# Altium project Sensor de temperatura.PrjPcb
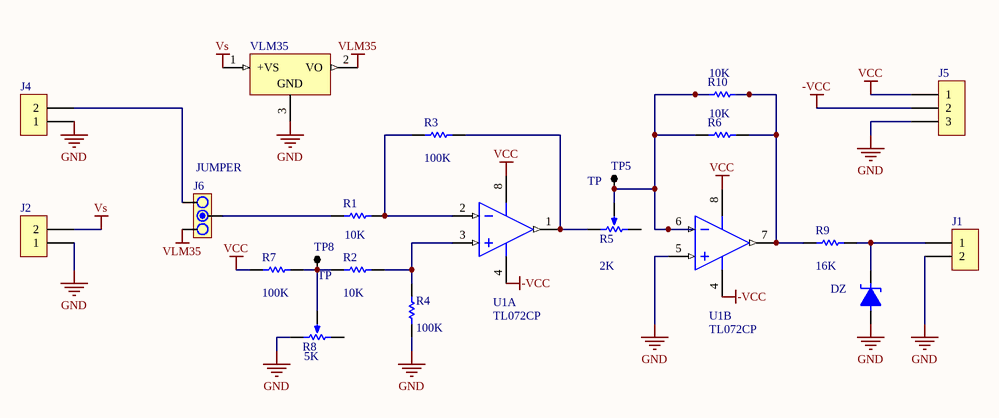
[diagram p0: Sheet1.SchDoc]
1 sheet, 20 parts. Net scope: global (net labels, ports and power ports of the same name join across sheets).
Board file: PCB1.PcbDoc

## Sheet Sheet1.SchDoc
size A4

### Parts
DZ  (no value)  [DO41]
J1  (no value)  [BORNERA2]
J2  (no value)  [BORNERA2]
J4  (no value)  [BORNERA2]
J5  (no value)  [BORNERA3]
J6  JUMPER  [JUMPER3]
R1  value 10K  [AXIAL-0.3]
R2  value 10K  [AXIAL-0.3]
R3  value 100K  [AXIAL-0.3]
R4  value 100K  [AXIAL-0.3]
R5  value 2K  [VR5]
R6  value 10K  [AXIAL-0.3]
R7  value 100K  [AXIAL-0.3]
R8  value 5K  [VR5]
R9  value 16K  [AXIAL-0.3]
R10  value 10K  [AXIAL-0.3]
TP5  TP  [TPTH]
TP8  TP  [TPTH]
U1  TL072CP  [TI-P8]  (parts A,B of 2)
VLM35  (no value)  [Z03A]

### Nets
-VCC: J5.2 U1.4(VCC-)
GND: DZ.1 J1.2 J2.1 J4.1 J5.3 R4.1 R8.2(BOT) U1.5(IN2+) VLM35.3(GND)
VCC: J5.1 R7.2 U1.8(VCC+)
VLM35: J6.1 VLM35.2(VO)
Vs: J2.2 VLM35.1(+VS)
NetDZ_2: DZ.2 J1.1 R9.1
NetJ4_2: J4.2 J6.3
NetJ6_2: J6.2 R1.1
NetR1_2: R1.2 R3.1 U1.2(IN1-)
NetR2_1: R2.1 R7.1 R8.3(TAP) TP8.1
NetR2_2: R2.2 R4.2 U1.3(IN1+)
NetR3_2: R3.2 R5.2(BOT) U1.1(OUT1)
NetR5_3: R5.3(TAP) R6.2 R10.1 TP5.1 U1.6(IN2-)
NetR6_1: R6.1 R9.2 R10.2 U1.7(OUT2)

Not connected (* = marked no-connect by the designer): R5 1(TOP); R8 1(TOP)

### Library data of the parts
DZ = DIODO ZENER
J1 J2 J4 = BORNERA 2
J5 = BORNERA 3
J6 = JUMPER3
R1-R4 R6 R7 R9 R10 = Res1: Resistor; Published: 8-Jun-2000; LatestRevisionDate: 17-Jul-2002; LatestRevisionNote: Re-released for DXP Platform.; PackageReference: AXIAL-0.3; Publisher: Altium Limited; PackageDescription: Axial Device, Thru-Hole; 2 Leads; 0.3 in Pin Spacing
R5 R8 = RPot: Potentiometer; Sim Note: Enter the Resistance value and the set point into parameter fields.; Set Position: 0.5; Published: 8-Jun-2000; LatestRevisionDate: 17-Jul-2002; LatestRevisionNote: Re-released for DXP Platform.; PackageReference: VR5; Publisher: Altium Limited; PackageDescription: Variable Resistor, Thru-Hole; 3 Leads
U1 = TL072CP: Dual Low-Noise JFET-Input General-Purpose Operational Amplifier, 7 to 36 V, 0 to 70 degC, 8-pin DIP (P8), Pb-Free (RoHS); Manufacturer: Texas Instruments; CMRR(Min)(dB): 70; GBW(Typ)(MHz): 3; IIB(Max)(pA): 200; Iq per channel(Max)(mA): 2.5; Number of Channels: 2; Offset Drift(Typ)(uV/C): 18; Rating: Catalog; Slew Rate(Typ)(V/us): 13; Sub Family: General Purpose Amplifier, High Supply Voltage Amplifier (>=30V); Total Supply Voltage(Max)(+5V is 5, +/-5V is 10): 36; Total Supply Voltage(Min)(+5V is 5, +/-5V is 10): 7; Vio (25C)(Max)(mV): 10; DatasheetVersion: SLOS080J; PackageVersion: 4040082/E, 04/2010; PackageReference: P8; PackageDescription: 8-Pin Plastic In-Line, Body 9.59 x 6.35 mm, Pitch 2.54 mm; Supplier 1: Digi-Key; Supplier Part Number 1: 296-1775-5-ND; Supplier 2: Farnell; Supplier Part Number 2: 1106015; Supplier 3: Newark; Supplier Part Number 3: 60K6988; Supplier 4: Mouser; Supplier Part Number 4: 595-TL072CP; Eco-Plan: Pb-Free (RoHS); Vn at 1kHz(Typ)(nV/rtHz): 18; Mounting Technology: Through Hole; Code_JEDEC: MS-001; PartNumber: TL072CP; ComponentLink1Description: Manufacturer URL; ComponentLink1URL: http://www.ti.com/; ComponentLink2Description: Datasheet; ComponentLink2URL: http://www.ti.com/lit/ds/symlink/tl072.pdf; ComponentLink3Description: Package Specification; ComponentLink3URL: http://www.ti.com/litv/pdf/mpdi001b
VLM35 = LM35CZ: Precision Centigrade Temperature Sensor, 3-pin TO-92; Manufacturer: National Semiconductor; PackageTopMarking: NSXYTT*LM35*CZ; PowerWise: N; CompType: Temp Sensor IC; Published: 4-Dec-2008; LatestRevisionDate: 15-Jul-2009; LatestRevisionNote: Sch pins 1 & 3 reversed.; DatasheetVersion: Nov-2000; PackageVersion: revG, Sep-2000; PackageReference: Z03A; Publisher: Altium Limited; PackageDescription: TO-92, Molded, 3 Lead; Supplier 1: Farnell; Supplier Part Number 1: 9488197; PartNumber: LM35CZ; RoHS: N; PinCount: 3; Code_JEDEC: TO-226-AA; ComponentLink1Description: LM35 Datasheet; ComponentLink1URL: http://www.national.com/ds/LM/LM35.pdf; ComponentLink2Description: LM35 Web Page; ComponentLink2URL: http://www.national.com/pf/LM/LM35.html; ComponentLink3Description: Z03A Package Page; ComponentLink3URL: http://www.national.com/packaging/folders/z03a.html